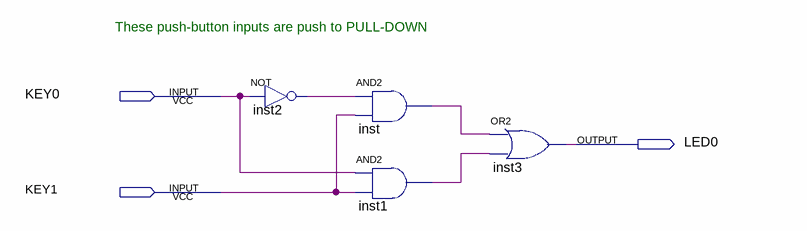
[diagram p0: schematic sheet]
// Quartus schematic comb_logic.bdf as structural Verilog: 4 symbols, 3 pins
module comb_logic (
  input  KEY0,
  input  KEY1,
  output LED0
);

  wire inst1_out, inst2_out, inst_out;

  not inst2 (inst2_out, KEY0);
  and inst (inst_out, inst2_out, KEY1);
  and inst1 (inst1_out, KEY0, KEY1);
  or inst3 (LED0, inst_out, inst1_out);

  // Notes on the sheet:
  //   These push-button inputs are push to PULL-DOWN
endmodule
